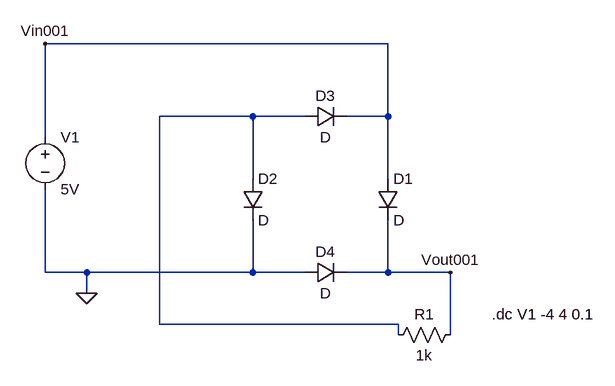
[diagram p0: schematic Task01VCT.asc]
Task01VCT.asc, the LTspice schematic file:
Version 4
SHEET 1 880 680
WIRE 192 -80 -336 -80
WIRE -16 32 -160 32
WIRE 64 32 -16 32
WIRE 192 32 192 -80
WIRE 192 32 128 32
WIRE -336 64 -336 -80
WIRE -16 128 -16 32
WIRE 192 128 192 32
WIRE -336 272 -336 144
WIRE -272 272 -336 272
WIRE -16 272 -16 192
WIRE -16 272 -272 272
WIRE 64 272 -16 272
WIRE 192 272 192 192
WIRE 192 272 128 272
WIRE 288 272 192 272
WIRE -272 304 -272 272
WIRE -160 352 -160 32
WIRE 208 352 -160 352
WIRE 208 368 208 352
WIRE 288 368 288 272
FLAG -272 304 0
FLAG -336 -80 Vin001
FLAG 288 272 Vout001
SYMBOL diode 176 128 R0
SYMATTR InstName D1
SYMBOL diode -32 128 R0
SYMATTR InstName D2
SYMBOL diode 64 48 R270
WINDOW 0 32 32 VTop 2
WINDOW 3 0 32 VBottom 2
SYMATTR InstName D3
SYMBOL diode 64 288 R270
WINDOW 0 32 32 VTop 2
WINDOW 3 0 32 VBottom 2
SYMATTR InstName D4
SYMBOL res 192 384 R270
WINDOW 0 32 56 VTop 2
WINDOW 3 0 56 VBottom 2
SYMATTR InstName R1
SYMATTR Value 1k
SYMBOL voltage -336 48 R0
WINDOW 123 0 0 Left 0
WINDOW 39 0 0 Left 0
SYMATTR InstName V1
SYMATTR Value 5V
TEXT 352 336 Left 2 !.dc V1 -4 4 0.1

The netlist it stands for:
* Task01VCT.asc
D1 Vin001 Vout001 D
D2 N001 0 D
D3 N001 Vin001 D
D4 0 Vout001 D
R1 N001 Vout001 1k
V1 Vin001 0 5V
.model D D
.lib standard.dio
.dc V1 -4 4 0.1
.backanno
.end

* Results of the author's LTspice run, read from the files saved beside the schematic
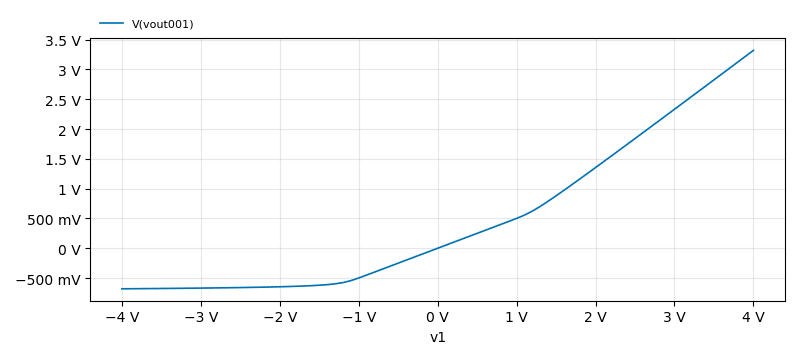
[diagram p1: DC transfer characteristic of Task01VCT.asc, plotted from the saved traces]
* DC transfer characteristic, 1 run:
*   V(vout001): -680.2 mV at v1=-4 V, 3.32 V at v1=4 V, min -680.2 mV, max 3.32 V